# EasyEDA schematic SCH_Moonshine.std_2026-02-26.json
TITLE: Sheet_1; REV: 1.0; Date: 2026-02-06; Sheet: 1/1; Drawn By: jimor; Company: Your Company
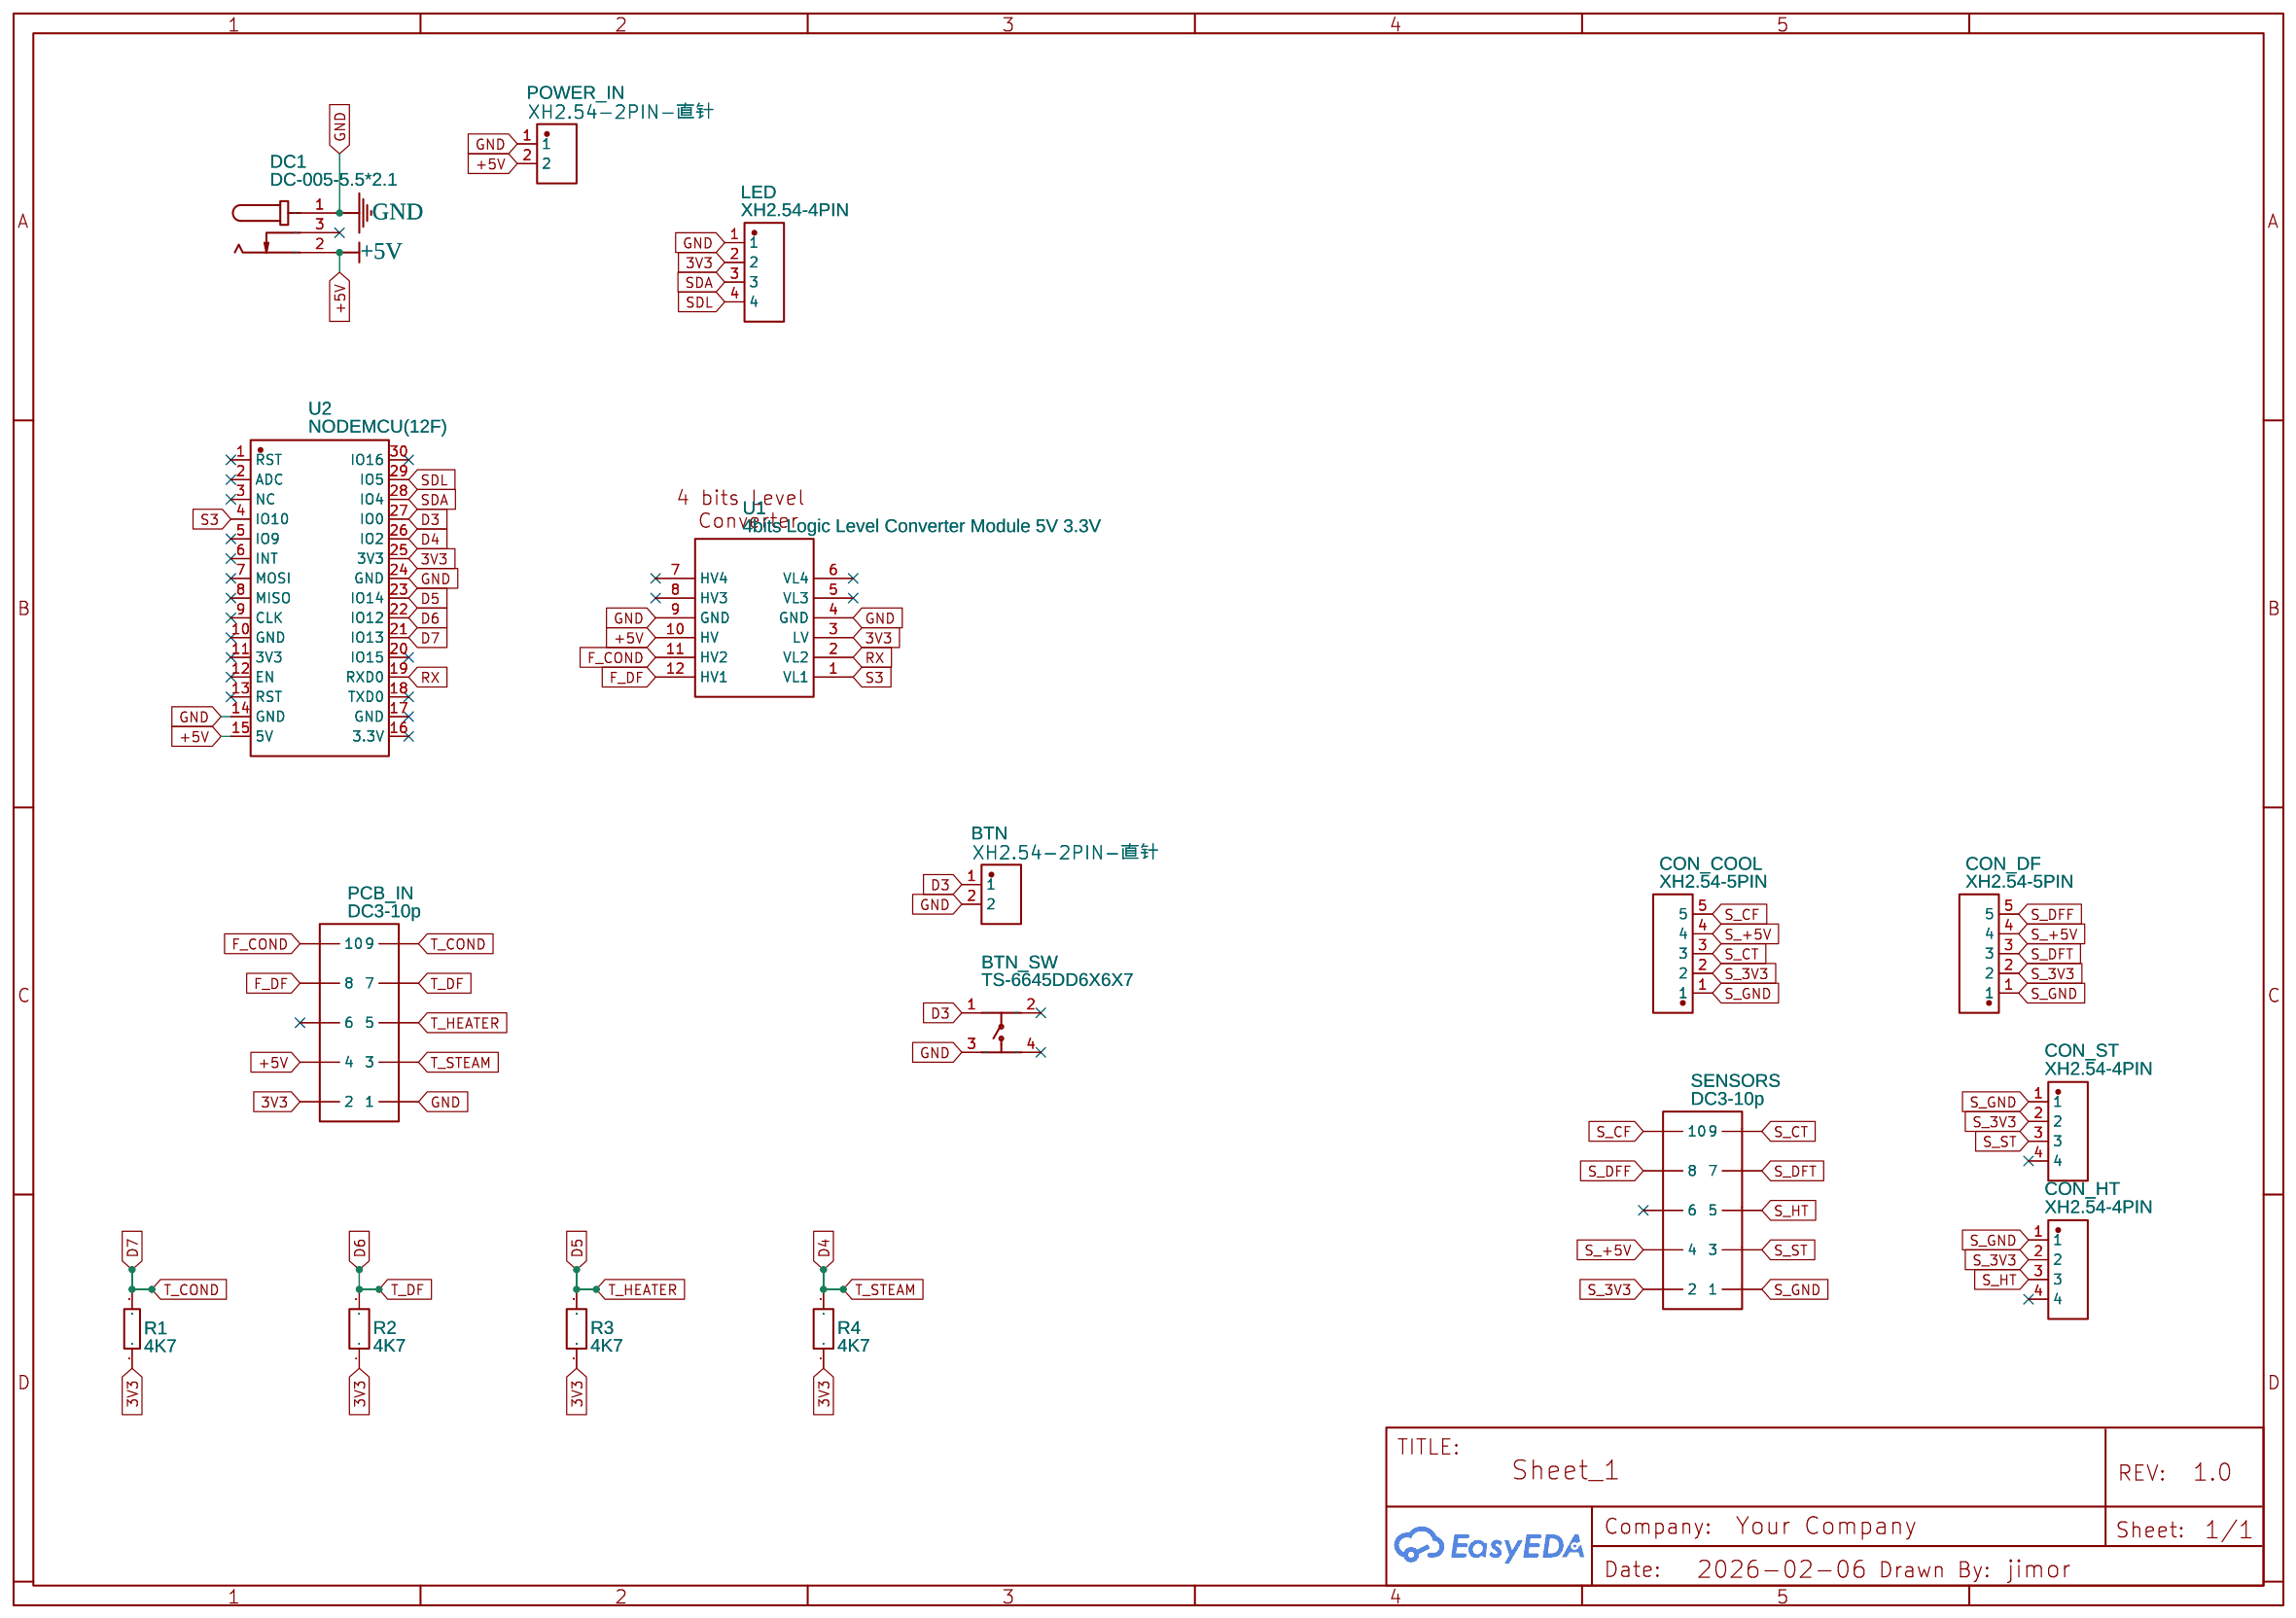
[diagram p0: schematic sheet]

## Parts
BTN  XH2.54-2PIN-直针  [CONN-TH_XH2.54-2P]
BTN_SW  TS-6645DD6X6X7  [SW-TH_4P-L6.0-W6.0-TS-6645DD6X6X7]
CON_COOL  XH2.54-5PIN  [HDR-TH-2.54-1ROW-5PIN-39MIL-FRUITLOOP57]
CON_DF  XH2.54-5PIN  [HDR-TH-2.54-1ROW-5PIN-39MIL-FRUITLOOP57]
CON_HT  XH2.54-4PIN  [CONN-TH_XH2.54-4]
CON_ST  XH2.54-4PIN  [CONN-TH_XH2.54-4]
DC1  DC-005-5.5*2.1  [DC-IN-TH_DC-005-2]
LED  XH2.54-4PIN  [CONN-TH_XH2.54-4]
PCB_IN  DC3-10p  [DC3-10P]
POWER_IN  XH2.54-2PIN-直针  [CONN-TH_XH2.54-2P]
R1  4K7  [RES-TH_BD2.2-L6.0-P10.00-D0.5]
R2  4K7  [RES-TH_BD2.2-L6.0-P10.00-D0.5]
R3  4K7  [RES-TH_BD2.2-L6.0-P10.00-D0.5]
R4  4K7  [RES-TH_BD2.2-L6.0-P10.00-D0.5]
SENSORS  DC3-10p  [DC3-10P]
U1  4bits Logic Level Converter Module 5V 3.3V  [4BITS_LOGIC_LEVEL_CONVERTER_BIDIRECTIONAL_5V_33V-10MM]
U2  NODEMCU(12F)  [WIFIM-TH_NODEMCU-8266]

## Library data of the parts
BTN POWER_IN = XH2.54-2PIN-直针: Contributor: LCSC; Supplier: LCSC; Supplier Part: C9900011425; Manufacturer: null; JLCPCB Part Class: Extended Part
BTN_SW = TS-6645DD6X6X7: Supplier: LCSC; Supplier Part: C51927194; Manufacturer: CAX(创都); Manufacturer Part: TS-6645DD6x6x7; Contributor: lcsc; JLCPCB Part Class: Extended Part
CON_COOL CON_DF = HDR-TH-2.54-1ROW-5PIN-39MIL-FRUITLOOP57: Contributor: evgeny.tzurckov; Supplier: LCSC; Supplier Part: C492404; Manufacturer: XFCN(兴飞); Manufacturer Part: PZ254V-11-05P; JLCPCB Part Class: Extended Part
CON_HT CON_ST LED = XH2.54-4PIN: Contributor: lcsc; Supplier: LCSC; Supplier Part: C9900014913; Manufacturer: null; JLCPCB Part Class: Extended Part
DC1 = DC-005-5.5*2.1: Contributor: lcsc; Supplier: LCSC; Supplier Part: C9900017044; Manufacturer: null; JLCPCB Part Class: Extended Part
PCB_IN SENSORS = DC3-10p: Contributor: nexsysnl
R1 = AXIAL-0.4: Contributor: lcsc; Supplier: LCSC; Supplier Part: C9900020985; Manufacturer: null; JLCPCB Part Class: Extended Part
R2-R4 = 3.3K-AXIAL-3.0: Contributor: lcsc; Supplier: LCSC; Supplier Part: C9900027048; Manufacturer: 睿思电阻
U1 = 4bits Logic Level Converter Module 5V 3.3V: Contributor: Игорь IOT; link: https://goo.gl/xLxZu8; Supplier: https://www.sparkfun.com/products/12009
U2 = NODEMCU(12F): Supplier: LCSC; Supplier Part: C2764098; Manufacturer: Ai-Thinker(安信可); Contributor: lcsc

## Nets
3V3: LED.2 PCB_IN.2 R1.1 R2.1 R3.1 R4.1 U1.3(LV) U2.25(3V3)
+5V: DC1.2 PCB_IN.4 POWER_IN.2 U1.10(HV) U2.15(5V)
GND: BTN.2 BTN_SW.3 DC1.1 LED.1 PCB_IN.1 POWER_IN.1 U1.4(GND) U1.9(GND) U2.14(GND) U2.24(GND)
D3: BTN.1 BTN_SW.1 U2.27(IO0)
D4: PCB_IN.3 R4.2 U2.26(IO2)
D5: PCB_IN.5 R3.2 U2.23(IO14)
D6: PCB_IN.7 R2.2 U2.22(IO12)
D7: PCB_IN.9 R1.2 U2.21(IO13)
F_COND: PCB_IN.10 U1.11(HV2)
F_DF: PCB_IN.8 U1.12(HV1)
RX: U1.2(VL2) U2.19(RXD0)
S3: U1.1(VL1) U2.4(IO10)
S_3V3: CON_COOL.2 CON_DF.2 CON_HT.2 CON_ST.2 SENSORS.2
S_+5V: CON_COOL.4 CON_DF.4 SENSORS.4
S_CF: CON_COOL.5 SENSORS.10
S_CT: CON_COOL.3 SENSORS.9
S_DFF: CON_DF.5 SENSORS.8
S_DFT: CON_DF.3 SENSORS.7
S_GND: CON_COOL.1 CON_DF.1 CON_HT.1 CON_ST.1 SENSORS.1
S_HT: CON_HT.3 SENSORS.5
S_ST: CON_ST.3 SENSORS.3
SDA: LED.3 U2.28(IO4)
SDL: LED.4 U2.29(IO5)

Not connected (* = marked no-connect by the designer): BTN_SW 2* 4*; CON_HT 4*; CON_ST 4*; DC1 3*; PCB_IN 6*; SENSORS 6*; U1 5(VL3)* 6(VL4)* 7(HV4)* 8(HV3)*; U2 1(RST)* 2(ADC)* 3(NC)* 5(IO9)* 6(INT)* 7(MOSI)* 8(MISO)* 9(CLK)* 10(GND)* 11(3V3)* 12(EN)* 13(RST)* 16(3.3V)* 17(GND)* 18(TXD0)* 20(IO15)* 30(IO16)*
